# Altium schematic sheet bluenrg.SchDoc
size A3
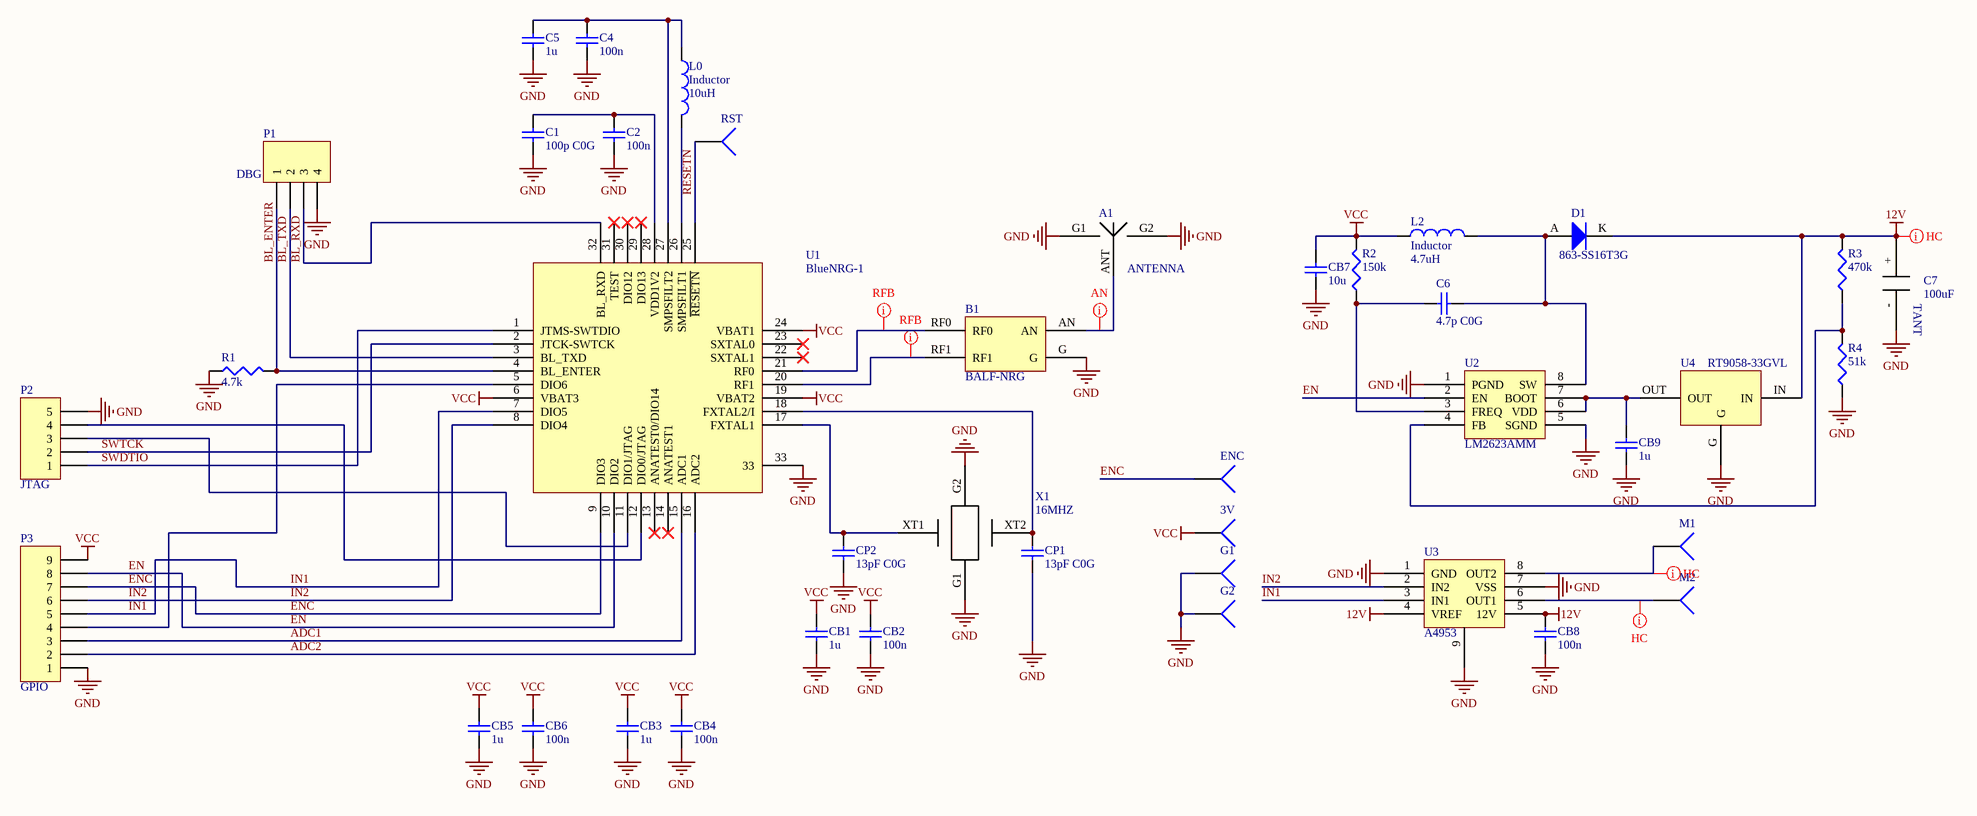
[diagram p0: bluenrg.SchDoc]

## Parts
3V  ENC  [MY_PAD]  (value not drawn)
A1  ANTENNA  [sma]
B1  BALF-NRG  [BALF-NRG]
C1  100p C0G  [MY_0603]
C2  100n  [MY_0603]
C4  100n  [MY_0603]
C5  1u  [MY_0603]
C6  4.7p C0G  [MY_0603]
C7  100uF  [100uf_tant]
CB1  1u  [MY_0603]
CB2  100n  [MY_0603]
CB3  1u  [MY_0603]
CB4  100n  [MY_0603]
CB5  1u  [MY_0603]
CB6  100n  [MY_0603]
CB7  10u  [MY_0805]
CB8  100n  [MY_0603]
CB9  1u  [MY_0805]
CP1  13pF C0G  [MY_0603]
CP2  13pF C0G  [MY_0603]
D1  863-SS16T3G  [403D]
ENC  ENC  [MY_PAD]  (value not drawn)
G1  ENC  [MY_PAD]  (value not drawn)
G2  ENC  [MY_PAD]  (value not drawn)
L0  Inductor  value 10uH  [MY_0805]
L2  Inductor  value 4.7uH  [MY_0805]
M1  M1  [MPAD]  (value not drawn)
M2  M2  [MPAD]  (value not drawn)
P1  DBG  [HDR1X4]
P2  JTAG  [HDR1X5]
P3  GPIO  [HDR1X9]
R1  4.7k  [MY_0603]
R2  150k  [MY_0603]
R3  470k  [MY_0603]
R4  51k  [MY_0603]
RST  M1  [MY_PAD]  (value not drawn)
U1  BlueNRG-1  [BlueNRG-1]
U2  LM2623AMM  [MSOP-8]
U3  A4953  [MY_SOIC8N_TP]
U4  RT9058-33GVL  [SOT-23-3L]
X1  16MHZ  [16MHZ_25_20]

## Nets
12V: C7.+ CB8.2 D1.K R3.2 U3.4(VREF) U3.5(12V) U4.IN
GND: A1.G1 A1.G2 B1.G C1.1 C2.1 C4.1 C5.1 C7.- CB1.1 CB2.1 CB3.1 CB4.1 CB5.1 CB6.1 CB7.1 CB8.1 CB9.1 CP1.1 CP2.1 G1.1 G2.1 P1.4 P2.5 P3.1 R1.1 R4.1 U1.33 U2.1(PGND) U2.5(SGND) U3.1(GND) U3.7(VSS) U3.9(G) U4.G X1.G1 X1.G2
VCC: 3V.1 CB1.2 CB2.2 CB3.2 CB4.2 CB5.2 CB6.2 CB7.2 L2.1 P3.9 R2.2 U1.6(VBAT3) U1.19(VBAT2) U1.24(VBAT1)
ADC1: P3.3 U1.15(ADC1)
ADC2: P3.2 U1.16(ADC2)
BL_ENTER: P1.1 R1.2 U1.4(BL_ENTER)
BL_RXD: P1.3 U1.32(BL_RXD)
BL_TXD: P1.2 U1.3(BL_TXD)
EN: P3.8 U1.10(DIO2) U2.2(EN)
ENC: ENC.1 P3.7 U1.9(DIO3)
IN1: P3.5 U1.7(DIO5) U3.3(IN1)
IN2: P3.6 U1.8(DIO4) U3.2(IN2)
RESETN: RST.1 U1.25(~{RESETN})
SWDTIO: P2.1 U1.1(JTMS-SWTDIO)
SWTCK: P2.2 U1.2(JTCK-SWTCK)
NetA1_ANT: A1.ANT B1.AN
NetB1_RF0: B1.RF0 U1.21(RF0)
NetB1_RF1: B1.RF1 U1.20(RF1)
NetC1_2: C1.2 C2.2 U1.28(VDD1V2)
NetC4_2: C4.2 C5.2 L0.1 U1.27(SMPSFILT2)
NetC6_1: C6.1 D1.A L2.2 U2.8(SW)
NetC6_2: C6.2 R2.1 U2.3(FREQ)
NetCB9_2: CB9.2 U2.6(VDD) U2.7(BOOT) U4.OUT
NetCP1_2: CP1.2 U1.18(FXTAL2/I) X1.XT2
NetCP2_2: CP2.2 U1.17(FXTAL1) X1.XT1
NetL0_2: L0.2 U1.26(SMPSFILT1)
NetM1_1: M1.1 U3.8(OUT2)
NetM2_1: M2.1 U3.6(OUT1)
NetP2_3: P2.3 U1.11(DIO1/JTAG)
NetP2_4: P2.4 U1.12(DIO0/JTAG)
NetP3_4: P3.4 U1.5(DIO6)
NetR3_1: R3.1 R4.2 U2.4(FB)

Not connected (* = marked no-connect by the designer): U1 13(ANATEST0/DIO14)* 14(ANATEST1)* 22(SXTAL1)* 23(SXTAL0)* 29(DIO13)* 30(DIO12)* 31(TEST)*

## Layout directives
net class HC: 12V, NetM1_1, NetM2_1
net class RFB: NetB1_RF0, NetB1_RF1
net class AN: NetA1_ANT

## Notes on the sheet
- (in symbol C_TANT) TANT

## Library data of the parts
3V ENC G1 G2 M1 M2 RST = Socket: LatestRevisionDate: 17-Jul-2002; LatestRevisionNote: Re-released for DXP Platform.; Publisher: Altium Limited
C1 C2 C4-C6 CB1-CB9 CP1 CP2 = Cap Semi: Capacitor (Semiconductor SIM Model); Value: 100pF; Published: 8-Jun-2000; LatestRevisionDate: 29-May-2009; LatestRevisionNote: IPC-7351 Footprint Added.; PackageReference: C1206; Publisher: Altium Limited; PackageDescription: Chip Capacitor
C7 = C_TANT
D1 = Diode: Default Diode; Published: 8-Jun-2000; LatestRevisionDate: 17-Jul-2002; LatestRevisionNote: Re-released for DXP Platform.; PackageVersion: Sep-1996; PackageReference: SMC; Publisher: Altium Limited; PackageDescription: DO-214-AB/SMC; 2 C-Bend Leads; Body 7.9 x 5.9 mm, inc. leads (LxW); Code_JEDEC: DO-214-AB
L0 L2 = Inductor: Code_IEC: 1005; Published: 8-Jun-2000; LatestRevisionDate: 29-May-2009; LatestRevisionNote: IPC-7351 Footprint Added.; PackageReference: 0402-A; Publisher: Altium Limited; PackageDescription: Chip Inductor; Code_JEITA: 0402
P1 = Header 4: Header, 4-Pin; LatestRevisionDate: 17-Jul-2002; LatestRevisionNote: Re-released for DXP Platform.; Publisher: Altium Limited
P2 = Header 5: Header, 5-Pin; LatestRevisionDate: 17-Jul-2002; LatestRevisionNote: Re-released for DXP Platform.; Publisher: Altium Limited
P3 = Header 9: Header, 9-Pin; LatestRevisionDate: 17-Jul-2002; LatestRevisionNote: Re-released for DXP Platform.; Publisher: Altium Limited
R1 = Res3: Resistor; Published: 8-Jun-2000; LatestRevisionDate: 29-May-2009; LatestRevisionNote: IPC-7351 Footprint Added.; PackageReference: J1-0603; Publisher: Altium Limited; PackageDescription: Chip Resistor; Value: 4.7K
R2-R4 = Res3: Resistor; Value: 4.7K; Published: 8-Jun-2000; LatestRevisionDate: 29-May-2009; LatestRevisionNote: IPC-7351 Footprint Added.; PackageReference: J1-0603; Publisher: Altium Limited; PackageDescription: Chip Resistor
U4 = LDO
X1 = XTAL_4PIN